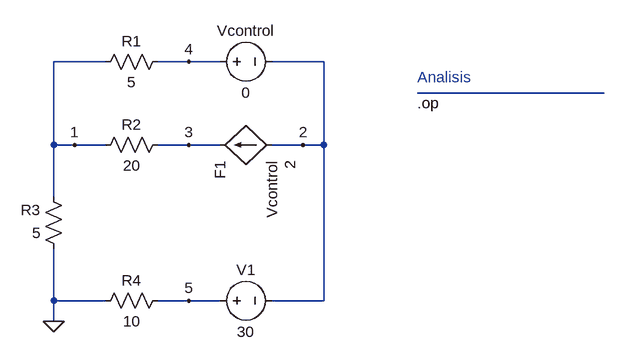
[diagram p0: schematic ejemplo3_voltajes_nodos.asc]
ejemplo3_voltajes_nodos.asc, the LTspice schematic file:
Version 4
SHEET 1 880 680
WIRE -96 0 -176 0
WIRE 32 0 -16 0
WIRE 80 0 32 0
WIRE 240 0 160 0
WIRE 672 48 384 48
WIRE -176 128 -176 0
WIRE -144 128 -176 128
WIRE -96 128 -144 128
WIRE 32 128 -16 128
WIRE 80 128 32 128
WIRE 208 128 160 128
WIRE 240 128 240 0
WIRE 240 128 208 128
WIRE -176 208 -176 128
WIRE -176 368 -176 288
WIRE -96 368 -176 368
WIRE 32 368 -16 368
WIRE 80 368 32 368
WIRE 240 368 240 128
WIRE 240 368 160 368
WIRE -176 400 -176 368
FLAG -176 400 0
FLAG -144 128 1
FLAG 208 128 2
FLAG 32 128 3
FLAG 32 0 4
FLAG 32 368 5
SYMBOL f 160 128 R90
WINDOW 0 24 80 Left 2
WINDOW 3 24 0 Left 2
WINDOW 123 24 -28 Left 2
SYMATTR InstName F1
SYMATTR Value Vcontrol
SYMATTR Value2 2
SYMBOL voltage 64 368 R270
WINDOW 0 32 56 VTop 2
WINDOW 3 -32 56 VBottom 2
SYMATTR InstName V1
SYMATTR Value 30
SYMBOL voltage 64 0 R270
WINDOW 0 32 56 VTop 2
WINDOW 3 -32 56 VBottom 2
SYMATTR InstName Vcontrol
SYMATTR Value 0
SYMBOL res 0 -16 R90
WINDOW 0 0 56 VBottom 2
WINDOW 3 32 56 VTop 2
SYMATTR InstName R1
SYMATTR Value 5
SYMBOL res 0 112 R90
WINDOW 0 0 56 VBottom 2
WINDOW 3 32 56 VTop 2
SYMATTR InstName R2
SYMATTR Value 20
SYMBOL res -160 304 R180
WINDOW 0 36 76 Left 2
WINDOW 3 36 40 Left 2
SYMATTR InstName R3
SYMATTR Value 5
SYMBOL res -112 384 R270
WINDOW 0 32 56 VTop 2
WINDOW 3 0 56 VBottom 2
SYMATTR InstName R4
SYMATTR Value 10
TEXT 384 64 Left 2 !.op
TEXT 384 24 Left 2 ;Analisis

The netlist it stands for:
* ejemplo3_voltajes_nodos.asc
F1 2 3 Vcontrol 2
V1 5 2 30
Vcontrol 4 2 0
R1 4 1 5
R2 3 1 20
R3 0 1 5
R4 0 5 10
.op
* Analisis
.backanno
.end